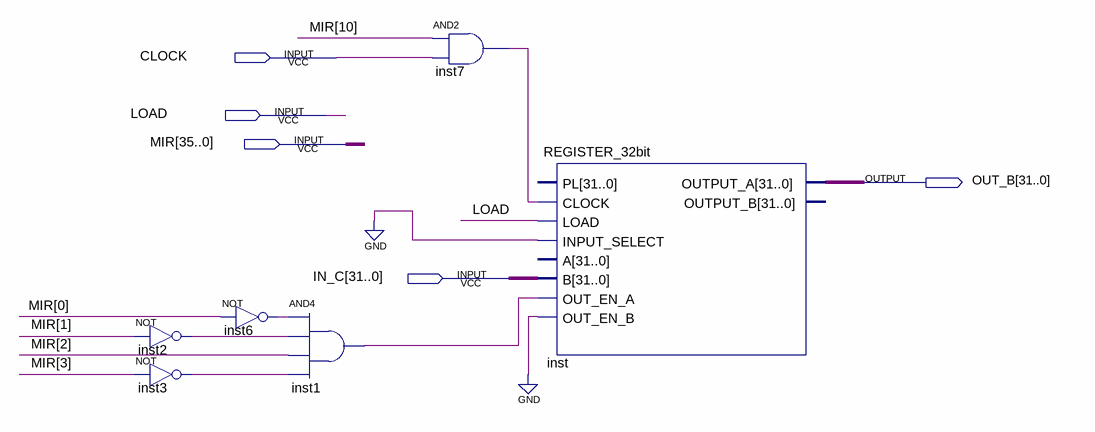
[diagram p0: schematic sheet]
// Quartus schematic SP.bdf as structural Verilog: 6 symbols, 5 pins
module SP (
  input  CLOCK,
  input  LOAD,
  input  [35:0] MIR,
  input  [31:0] IN_C,
  output [31:0] OUT_B
);

  wire inst1_out, inst2_out, inst3_out, inst6_out, inst7_out;

  not inst2 (inst2_out, MIR[1]);
  not inst3 (inst3_out, MIR[3]);
  not inst6 (inst6_out, MIR[0]);
  and inst1 (inst1_out, inst6_out, inst2_out, MIR[2], inst3_out);
  and inst7 (inst7_out, MIR[10], CLOCK);
  REGISTER_32bit inst (
    .CLOCK(inst7_out), .LOAD(LOAD), .INPUT_SELECT(1'b0), .B(IN_C), .OUT_EN_A(inst1_out), .OUT_EN_B(1'b0),
    .OUTPUT_A(OUT_B));  // open: PL, A, OUTPUT_B
endmodule
